# Altium schematic sheet STeaMi-FP2-Chargeur_de_batterie.SchDoc
size A3; DocumentNumber: 1; SheetNumber: 3; SheetTotal: 16
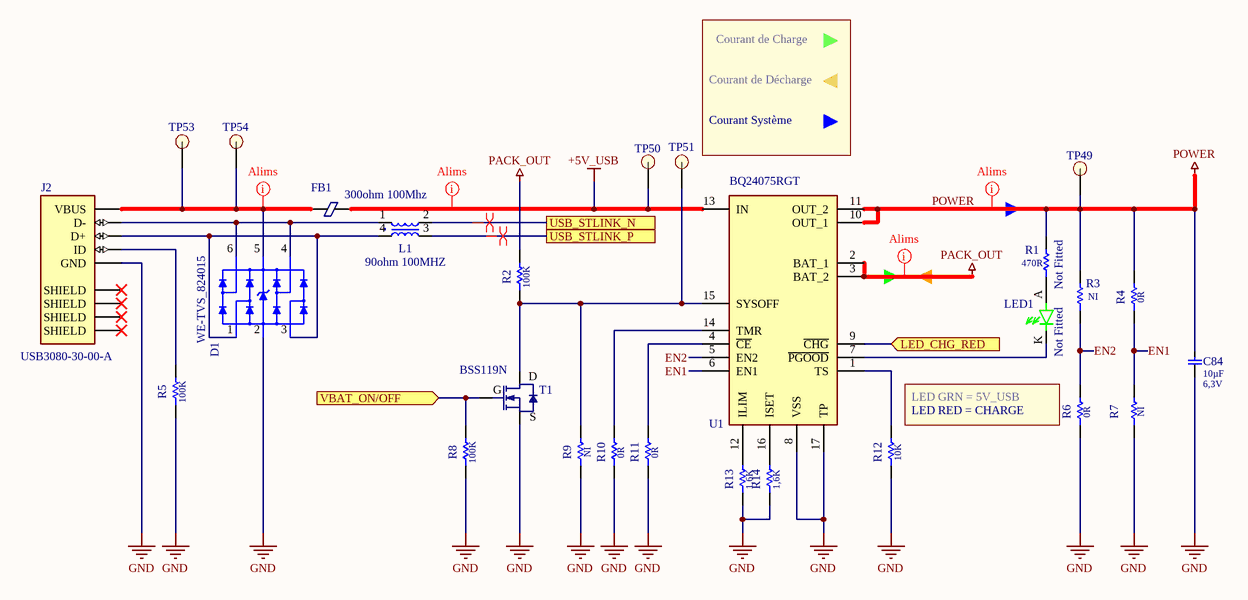
[diagram p0: STeaMi-FP2-Chargeur_de_batterie.SchDoc]

## Parts
C84  Capacitance: 10µF  Voltage: 6,3V  [0402-CAP]
D1  (no value)  [WE-TVS_SOT23-6L]
FB1  value 300ohm 100Mhz  [INDC1608X80N]
J2  (no value)  [USB3080-30-00-A]
L1  value 90ohm 100MHZ  [WE-CNSW_06038]
LED1  Fitted: Not Fitted  [APTD1608LZGCK-G]
R1  Not Fitted  Resistance: 470R  [RESC1005X40N_0402]
R2  Resistance: 100K  [RESC1005X40N_0402]
R3  (no value)  [RESC1005X40N_0402]
R4  Resistance: 0R  [RESC1005X40N_0402]
R5  Resistance: 100K  [RESC1005X40N_0402]
R6  Resistance: 0R  [RESC1005X40N_0402]
R7  (no value)  [RESC1005X40N_0402]
R8  Resistance: 100K  [RESC1005X40N_0402]
R9  (no value)  [RESC1005X40N_0402]
R10  Resistance: 0R  [RESC1005X40N_0402]
R11  Resistance: 0R  [RESC1005X40N_0402]
R12  Resistance: 10K  [RESC1005X40N_0402]
R13  Resistance: 1,6K  [RESC1005X40N_0402]
R14  Resistance: 1,6K  [RESC1005X40N_0402]
T1  (no value)  [SOT95P260X110-3N_SOT-23-3]
TP49  PAD  [Testpoint 1mm]  (value not drawn)  (no BOM)
TP50  PAD  [Testpoint 1mm]  (value not drawn)  (no BOM)
TP51  PAD  [Testpoint 1mm]  (value not drawn)  (no BOM)
TP53  PAD  [Testpoint 1mm]  (value not drawn)  (no BOM)
TP54  PAD  [Testpoint 1mm]  (value not drawn)  (no BOM)
U1  (no value)  [QFN50P300X300X100-17N]

## Ports
LED_CHG_RED (in), USB_STLINK_N, USB_STLINK_P, VBAT_ON/OFF (in)

## Nets
+5V_USB: FB1.2 TP50.1 U1.13(IN)
GND: C84.1 D1.2(GND) J2.5(GND) R5.1 R6.1 R7.1 R8.1 R9.1 R10.1 R11.1 R12.1 R13.1 R14.1 T1.2(SOURCE) U1.8(VSS) U1.17(TP)
PACK_OUT: R2.2 U1.2(BAT_1) U1.3(BAT_2)
POWER: C84.2 R1.2 R3.2 R4.2 TP49.1 U1.10(OUT_1) U1.11(OUT_2)
EN1: R4.1 R7.2 U1.6(EN1)
EN2: R3.1 R6.2 U1.5(EN2)
LED_CHG_RED: U1.9(~{CHG}) ; port LED_CHG_RED
USB_STLINK_N: L1.2 ; port USB_STLINK_N
USB_STLINK_P: L1.3 ; port USB_STLINK_P
VBAT_ON/OFF: R8.2 T1.1(GATE) ; port VBAT_ON/OFF
NetD1_1: D1.1 D1.3 J2.3(D+) L1.4
NetD1_4: D1.4 D1.6 J2.2(D-) L1.1
NetD1_5: D1.5(VDD) FB1.1 J2.1(VBUS) TP53.1 TP54.1
NetJ2_4: J2.4(ID) R5.2
NetLED1_A: LED1.A R1.1
NetLED1_K: LED1.K U1.7(~{PGOOD})
NetR2_1: R2.1 R9.2 T1.3(DRAIN) TP51.1 U1.15(SYSOFF)
NetR10_2: R10.2 U1.14(TMR)
NetR11_2: R11.2 U1.4(~{CE})
NetR12_2: R12.2 U1.1(TS)
NetR13_2: R13.2 U1.12(ILIM)
NetR14_2: R14.2 U1.16(ISET)

Not connected (* = marked no-connect by the designer): J2 6(SHIELD)* 7(SHIELD)* 8(SHIELD)* 9(SHIELD)*

## Layout directives
net class Alims; rule Width Constraint [Pref Width = 0.35mm    Min Width = 0.3mm    Max Width = 0.4mm]: NetD1_5
net class Alims: +5V_USB, PACK_OUT, POWER
differential pair: USB_STLINK_N, USB_STLINK_P

## Notes on the sheet
- Courant de Charge
- Courant de Décharge
- (near TP51) Courant Système
- (near R12) LED GRN = 5V_USB
- (near R12) LED RED = CHARGE
- Le présent document est la propriété exclusive de SmartEmbed. Remis à titre confidentiel, il ne peut être communiqué
- IND
- DATE
- DESCRIPTION
- VISA
- à des tiers, ni utilisé ou reproduit qu'en stricte conformité d'autorisations expresses préalables.
- Etabli le:
- Verifié le:
- Validé le:
- Par:
- Page:
- /
- Pépinière CleanTech Domaine du Petit Arbois Avenue Louis Philibert BP 80058 13792 AIX-EN-PROVENCE CEDEX 3
- REFERENCE
- DESIGNATION
- (in symbol BSS119N) D; G; S

## Library data of the parts
C84 = 10µF-20%-6,3V-X5R-0402: CAP CER 10µF 6,3V X5R 0402; Manufacturer: Murata; Manufacturer Part Number: GRM155R60J106ME15D; Populated: True; std Package: 0402; Tolerence: 0,2; Vérification: Non; Created by: EAG; Creation Date: 01/04/2021; Checked by: *; Part Number: 10µF-20%-6,3V-X5R-0402; Dielectric: X5R; Digikey: 490-13238-1-ND; Farnell: -; Mouser: 81-GRM155R60J106ME5D; RS: -; Switch possibility: True
D1 = WE-TVS_824015: Suppresseurs ESD / diodes TVS WE-TVS High Speed 5uA 5VDC 4+1; Manufacturer: Wurth; Populated: True; Switch possibility: False; Voltage: 5V; Vérification: Non; Created by: EAG; Creation Date: 27/08/2021; Manufacturer Part Number: WE-TVS_824015; ComponentLink1Description: Datasheet; ComponentLink1URL: https://www.we-online.com/catalog/datasheet/824015.pdf; Part Number: WE-TVS_824015; Mouser: 710-824015
FB1 = 742792641: Chip Ferrite Bead 300 ohm à 100MHZ; Manufacturer: WURTH; Populated: True; Switch possibility: False; Vérification: Non; Created by: EAG; Creation Date: 27/08/2021; Manufacturer Part Number: 742792641; Checked by: *; Part Number: 742792641; Mouser: 710-742792641
J2 = USB3080-30-00-A: Connector micro USB Bottom-SMT No Peg; Manufacturer: GCT; Populated: False; Switch possibility: False; Vérification: Non; Checked by: *; Creation Date: 27/08/2021; Created by: EAG; Manufacturer Part Number: USB3080-30-00-A; Part Number: USB3080-30-00-A; Mouser: 640-USB3080-30-00-A
L1 = 744230900: Common mode chokes; Manufacturer: WURTH; Populated: True; Switch possibility: False; Vérification: Non; Created by: EAG; Creation Date: 10/10/2019; Manufacturer Part Number: 744230900; Inductance: ="Inductance"; Part Number: 744230900; Digikey: 732-2582-1-ND
LED1 = 150060VS75000: LED GREEN 2V 20mA 0603 SMD; Manufacturer: WURTH; Populated: True; Color: GREEN RED; F19: 0,13; Switch possibility: False; Vérification: Non; Created by: EAG; Creation Date: 12/03/2020; Manufacturer Part Number: 150060VS75000; Part Number: 150060VS75000; Mouser: 710-150060VS75000
R1 = 470R-5%-0,1W-0402: RES CMS 470R5%-0,1W-0402 ±200ppm/°C; Manufacturer: Panasonic; Manufacturer Part Number: ERJ-2GEJ471X; Populated: True; Power: 0,1; Nom vérificateur: Non; Prix: 0,09; std Package: 0402; Tolerence: 0,05; Created by: EAG; Creation Date: 02/12/2021; Part Number: 470R-5%-0,1W-0402; Mouser: 667-ERJ-2GEJ471X; Switch possibility: True
R2 R5 R8 = 100K-5%-0,0625W-0402: RES CMS 100K5%-0,0625W-0402 ±100ppm/°C; Manufacturer: Yageo; Manufacturer Part Number: RC0402JR-07100KL; Populated: True; Power: 0,0625; Nom vérificateur: Non; Prix: 0,09; std Package: 0402; Tolerence: 0,05; Created by: EAG; Creation Date: 02/12/2021; Part Number: 100K-5%-0,0625W-0402; Digikey: 311-100KJRCT-ND; Farnell: 9233008; Switch possibility: True
R3 R7 R9 = NI-1%-0,1W-0603: NI; Populated: True; Power: 0,1; Nom vérificateur: Non; std Package: 0603; Tolerence: 0,01; Created by: MSA; Creation Date: 20/03/2019; Manufacturer: -; Manufacturer Part Number: -; Resistance: NI; Part Number: NI-1%-0,1W-0603; Digikey: -; Farnell: -; Mouser: -; RS: -; Switch possibility: True
R4 R6 R10 R11 = 0R-5%-0,0625W-0402: RES CMS 0R5%-0,0625W-0402; Manufacturer: Yageo; Manufacturer Part Number: RC0402JR-100RL; Populated: True; Power: 0,0625; Nom vérificateur: Non; Prix: 0,09; std Package: 0402; Tolerence: 0,05; Created by: EAG; Creation Date: 02/12/2021; Part Number: 0R-5%-0,0625W-0402; Mouser: 603-RC0402JR-100RL; Switch possibility: True
R12 = 10K-1%-0,0625W-0402: RES CMS 10K1%-0,0625W-0402 ±100ppm/°C; Manufacturer: Yageo; Manufacturer Part Number: AC0402FR-1310KL; Populated: True; Power: 0,0625; Nom vérificateur: Non; Prix: 0,088; std Package: 0402; Tolerence: 0,01; Created by: EAG; Creation Date: 08/06/2021; Part Number: 10K-1%-0,0625W-0402; Mouser: 603-AC0402FR-1310KL; Switch possibility: True
R13 R14 = 1,6K-1%-0,1W-0402: RES CMS 1,6K1%-0,1W-0402 ±100ppm/°C; Manufacturer: Panasonic; Manufacturer Part Number: ERJ-2RKF 1601X; Populated: True; Power: 0,1; Nom vérificateur: Non; Prix: 0,09; std Package: 0402; Tolerence: 0,01; Created by: EAG; Creation Date: 02/12/2021; Part Number: 1,6K-1%-0,1W-0402; Mouser: 667-ERJ-2RKF1601X; Switch possibility: True
T1 = BSS119N: Small-Signal-Transitor MOSFET N; Manufacturer: Infineon; Manufacturer Part Number: BSS119N-H6327; Populated: False; Switch possibility: False; Vérification: Oui; Checked by: MSA; Created by: EAG; Creation Date: 16/08/2018; ComponentLink1Description: Datasheet; ComponentLink1URL: https://www.infineon.com/dgdl/Infineon-BSS119N-DS-v02_01-en.pdf?fileId=db3a304335f1f4b6013639b6532a164a; Part Number: BSS119N; Digikey: BSS119NH6327XTSA1CT-ND; Farnell: -; Mouser: 726-BSS119NH6327; RS: -
TP49-TP51 TP53 TP54 = TESTPOINTPAD: Manufacturer: Smartembed; Switch possibility: False; Vérification: Non; Package: PAD_TEST; Part Number: TESTPOINTPAD; Created by: EAG; Creation Date: 11/03/2020; Digikey: -; Farnell: -; Manufacturer Part Number: TESTPOINT; Mouser: -; RS: -
U1 = BQ24075RGT: Standalone 1 cell 1,5A batterry with PowerPath; Manufacturer: Texas Instruments; Populated: False; Switch possibility: False; Vérification: Non; Created by: EAG; Creation Date: 27/08/2021; Checked by: *; Ambient Temperature: ='Ambient temp'; Storage temperature: ='Storage temp'; Current: *; RoHs compliant: ='Rohs'; Datasheet: ='Datasheet'; Manufacturer Part Number: BQ24075RGT; Part Number: BQ24075RGT; Mouser: 595-BQ24075RGTR